# EAGLE design robot_dripper (EAGLE 9.6.2)
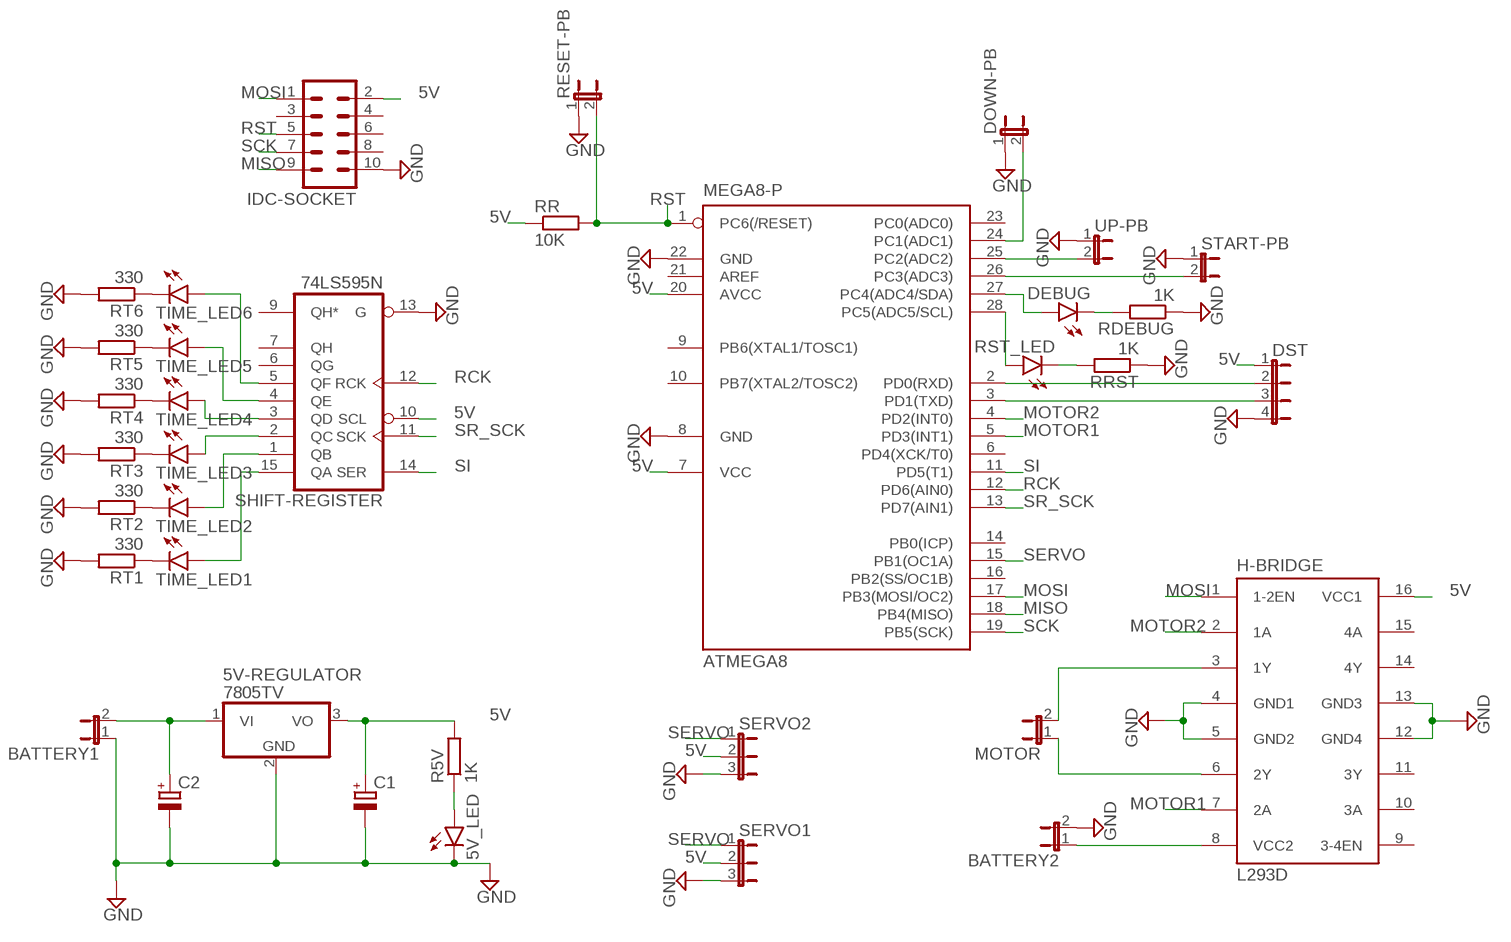
[diagram p0: schematic, sheet 1]

## Parts
5V-REGULATOR  7805TV  [TO220V]
5V_LED  LED5MM  [LED5MM]
ATMEGA8  MEGA8-P  [DIL28-3]
BATTERY1  JP1E  [JP1]
BATTERY2  JP1E  [JP1]
C1  CPOL-EUE5-10.5  [E5-10,5]
C2  CPOL-EUE5-10.5  [E5-10,5]
DEBUG  LED5MM  [LED5MM]
DOWN-PB  JP1E  [JP1]
DST  JP4E  [JP4]
H-BRIDGE  L293D  [DIL16]
IDC-SOCKET  ML10  [ML10]
MOTOR  JP1E  [JP1]
R5V  1K  R-EU_0207/10  [0207/10]
RDEBUG  1K  R-EU_0207/10  [0207/10]
RESET-PB  JP1E  [JP1]
RR  10K  R-EU_0207/10  [0207/10]
RRST  1K  R-EU_0207/10  [0207/10]
RST_LED  LED5MM  [LED5MM]
RT1  330  R-EU_0207/10  [0207/10]
RT2  330  R-EU_0207/10  [0207/10]
RT3  330  R-EU_0207/10  [0207/10]
RT4  330  R-EU_0207/10  [0207/10]
RT5  330  R-EU_0207/10  [0207/10]
RT6  330  R-EU_0207/10  [0207/10]
SERVO1  JP2E  [JP2]
SERVO2  JP2E  [JP2]
SHIFT-REGISTER  74LS595N  [DIL16]
START-PB  JP1E  [JP1]
TIME_LED1  LED5MM  [LED5MM]
TIME_LED2  LED5MM  [LED5MM]
TIME_LED3  LED5MM  [LED5MM]
TIME_LED4  LED5MM  [LED5MM]
TIME_LED5  LED5MM  [LED5MM]
TIME_LED6  LED5MM  [LED5MM]
UP-PB  JP1E  [JP1]

## Nets
5V: 5V-REGULATOR.3(VO) ATMEGA8.7(VCC) ATMEGA8.20(AVCC) C1.+ DST.1 H-BRIDGE.16(VCC1) IDC-SOCKET.2 R5V.2 RR.1 SERVO1.2 SERVO2.2 SHIFT-REGISTER.10(SCL)
GND: 5V-REGULATOR.2(GND) 5V_LED.K(C) ATMEGA8.8(GND) ATMEGA8.22(GND) BATTERY1.1 BATTERY2.2 C1.- C2.- DOWN-PB.1 DST.4 H-BRIDGE.4(GND1) H-BRIDGE.5(GND2) H-BRIDGE.12(GND4) H-BRIDGE.13(GND3) IDC-SOCKET.10 RDEBUG.1 RESET-PB.1 RRST.1 RT1.2 RT2.2 RT3.2 RT4.2 RT5.2 RT6.2 SERVO1.3 SERVO2.3 SHIFT-REGISTER.13(G) START-PB.1 UP-PB.1
MISO: ATMEGA8.18(PB4(MISO)) IDC-SOCKET.9
MOSI: ATMEGA8.17(PB3(MOSI/OC2)) H-BRIDGE.1(1-2EN) IDC-SOCKET.1
MOTOR1: ATMEGA8.5(PD3(INT1)) H-BRIDGE.7(2A)
MOTOR2: ATMEGA8.4(PD2(INT0)) H-BRIDGE.2(1A)
N$1: ATMEGA8.28(PC5(ADC5/SCL)) RST_LED.A
N$2: 5V_LED.A R5V.1
N$3: RRST.2 RST_LED.K(C)
N$4: ATMEGA8.27(PC4(ADC4/SDA)) DEBUG.A
N$5: DEBUG.K(C) RDEBUG.2
N$6: ATMEGA8.26(PC3(ADC3)) START-PB.2
N$7: ATMEGA8.25(PC2(ADC2)) UP-PB.2
N$8: ATMEGA8.24(PC1(ADC1)) DOWN-PB.2
N$9: ATMEGA8.2(PD0(RXD)) DST.2
N$10: ATMEGA8.3(PD1(TXD)) DST.3
N$11: H-BRIDGE.6(2Y) MOTOR.1
N$12: SHIFT-REGISTER.15(QA) TIME_LED1.A
N$13: SHIFT-REGISTER.1(QB) TIME_LED2.A
N$14: SHIFT-REGISTER.2(QC) TIME_LED3.A
N$15: H-BRIDGE.3(1Y) MOTOR.2
N$16: SHIFT-REGISTER.3(QD) TIME_LED4.A
N$17: SHIFT-REGISTER.4(QE) TIME_LED5.A
N$18: SHIFT-REGISTER.5(QF) TIME_LED6.A
N$19: RT1.1 TIME_LED1.K(C)
N$20: RT2.1 TIME_LED2.K(C)
N$21: RT3.1 TIME_LED3.K(C)
N$22: RT4.1 TIME_LED4.K(C)
N$23: RT5.1 TIME_LED5.K(C)
N$24: RT6.1 TIME_LED6.K(C)
N$25: BATTERY2.1 H-BRIDGE.8(VCC2)
N$26: 5V-REGULATOR.1(VI) BATTERY1.2 C2.+
RCK: ATMEGA8.12(PD6(AIN0)) SHIFT-REGISTER.12(RCK)
RST: ATMEGA8.1(PC6(/RESET)) IDC-SOCKET.5 RESET-PB.2 RR.2
SCK: ATMEGA8.19(PB5(SCK)) IDC-SOCKET.7
SERVO: ATMEGA8.15(PB1(OC1A)) SERVO1.1 SERVO2.1
SI: ATMEGA8.11(PD5(T1)) SHIFT-REGISTER.14(SER)
SR_SCK: ATMEGA8.13(PD7(AIN1)) SHIFT-REGISTER.11(SCK)
Unconnected: ATMEGA8.6(PD4(XCK/T0)) ATMEGA8.9(PB6(XTAL1/TOSC1)) ATMEGA8.10(PB7(XTAL2/TOSC2)) ATMEGA8.14(PB0(ICP)) ATMEGA8.16(PB2(SS/OC1B)) ATMEGA8.21(AREF) ATMEGA8.23(PC0(ADC0)) H-BRIDGE.9(3-4EN) H-BRIDGE.10(3A) H-BRIDGE.11(3Y) H-BRIDGE.14(4Y) H-BRIDGE.15(4A) IDC-SOCKET.3 IDC-SOCKET.4 IDC-SOCKET.6 IDC-SOCKET.8 SHIFT-REGISTER.6(QG) SHIFT-REGISTER.7(QH) SHIFT-REGISTER.9(QH*)

## Power pins joined to a net without a drawn wire
5V: SHIFT-REGISTER.16(VCC)
GND: SHIFT-REGISTER.8(GND)

## Library data of the parts
5V-REGULATOR = linear:78*: Positive VOLTAGE REGULATOR Source: http://cache.national.com/ds/LM/LM78L05.pdf http://www.fairchildsemi.com/ds/LM/LM7805.pdf
5V_LED DEBUG RST_LED TIME_LED1-TIME_LED6 = led:LED: LED OSRAM: - CHIPLED LG R971, LG N971, LY N971, LG Q971, LY Q971, LO R971, LY R971 LH N974, LH R974 LS Q976, LO Q976, LY Q976 LO Q996 - Hyper CHIPLED LW Q18S LB Q993, LB Q99A, LB R99A - SideLED LS A670, LO A670, LY A670, LG A670, LP A670 LB A673, LV A673, LT A673, LW A673 LH A674 LY A675 LS A676, LA A676, LO A676, LY A676, LW A676 LS A679, LY A679, LG A679 - Hyper Micro SIDELED® LS Y876, LA Y876, LO Y876, LY Y876 LT Y87S - SmartLED LW L88C, LW L88S LB L89C, LB L89S, LG L890 LS L89K, LO L89K, LY L89K LS L896, LA L896, LO L896, LY L896 - TOPLED LS T670, LO T670, LY T670, LG T670, LP T670 LSG T670, LSP T670, LSY T670, LOP T670, LYG T670 LG T671, LOG T671, LSG T671 LB T673, LV T673, LT T673, LW T673 LH T674 LS T676, LA T676, LO T676, LY T676, LB T676, LH T676, LSB T676, LW T676 LB T67C, LV T67C, LT T67C, LS T67K, LO T67K, LY T67K, LW E67C LS E67B, LA E67B, LO E67B, LY E67B, LB E67C, LV E67C, LT E67C LW T67C LS T679, LY T679, LG T679 LS T770, LO T770, LY T770, LG T770, LP T770 LB T773, LV T773, LT T773, LW T773 LH T774 LS E675, LA E675, LY E675, LS T675 LS T776, LA T776, LO T776, LY T776, LB T776 LHGB T686 LT T68C, LB T68C - Hyper Mini TOPLED® LB M676 - Mini TOPLED Santana® LG M470 LS M47K, LO M47K, LY M47K Source: http://www.osram.convergy.de LUXEON: - LUMILED® LXK2-PW12-R00, LXK2-PW12-S00, LXK2-PW14-U00, LXK2-PW14-V00 LXK2-PM12-R00, LXK2-PM12-S00, LXK2-PM14-U00 LXK2-PE12-Q00, LXK2-PE12-R00, LXK2-PE12-S00, LXK2-PE14-T00, LXK2-PE14-U00 LXK2-PB12-K00, LXK2-PB12-L00, LXK2-PB12-M00, LXK2-PB14-N00, LXK2-PB14-P00, LXK2-PB14-Q00 LXK2-PR12-L00, LXK2-PR12-M00, LXK2-PR14-Q00, LXK2-PR14-R00 LXK2-PD12-Q00, LXK2-PD12-R00, LXK2-PD12-S00 LXK2-PH12-R00, LXK2-PH12-S00 LXK2-PL12-P00, LXK2-PL12-Q00, LXK2-PL12-R00 Source: www.luxeon.com KINGBRIGHT: KA-3528ASYC Source: www.kingbright.com
ATMEGA8 = atmel:MEGA8-P: MICROCONTROLLER 8 Kbytes FLASH, 1 kbytes SRAM, 512 bytes EEPROM, USART, 4-channel 10 bit ADC, 2-channel 8 bit ADC Pin compatible with Atmega48, ATMega88, ATMega168 Source: avr.lbr; OC_FARNELL: unknown; OC_NEWARK: unknown
BATTERY1 BATTERY2 DOWN-PB MOTOR RESET-PB START-PB UP-PB = jumper:JP1E: JUMPER
C1 C2 = rcl:CPOL-EU: POLARIZED CAPACITOR, European symbol; SPICEPREFIX: C
DST = jumper:JP4E: JUMPER
H-BRIDGE = st-microelectronics:L293D: PUSH-PULL 4 CHANNEL DRIVER; MPN: L293D; OC_FARNELL: 9589619; OC_NEWARK: 56P8249
IDC-SOCKET = con-harting-ml:ML10: HARTING; OC_FARNELL: unknown; OC_NEWARK: unknown
R5V RDEBUG RR RRST RT1-RT6 = rcl:R-EU_: RESISTOR, European symbol; SPICEPREFIX: R
SERVO1 SERVO2 = jumper:JP2E: JUMPER
SHIFT-REGISTER = 74xx-us:74*595: 8-bit SHIFT REGISTER, output latch

## Board
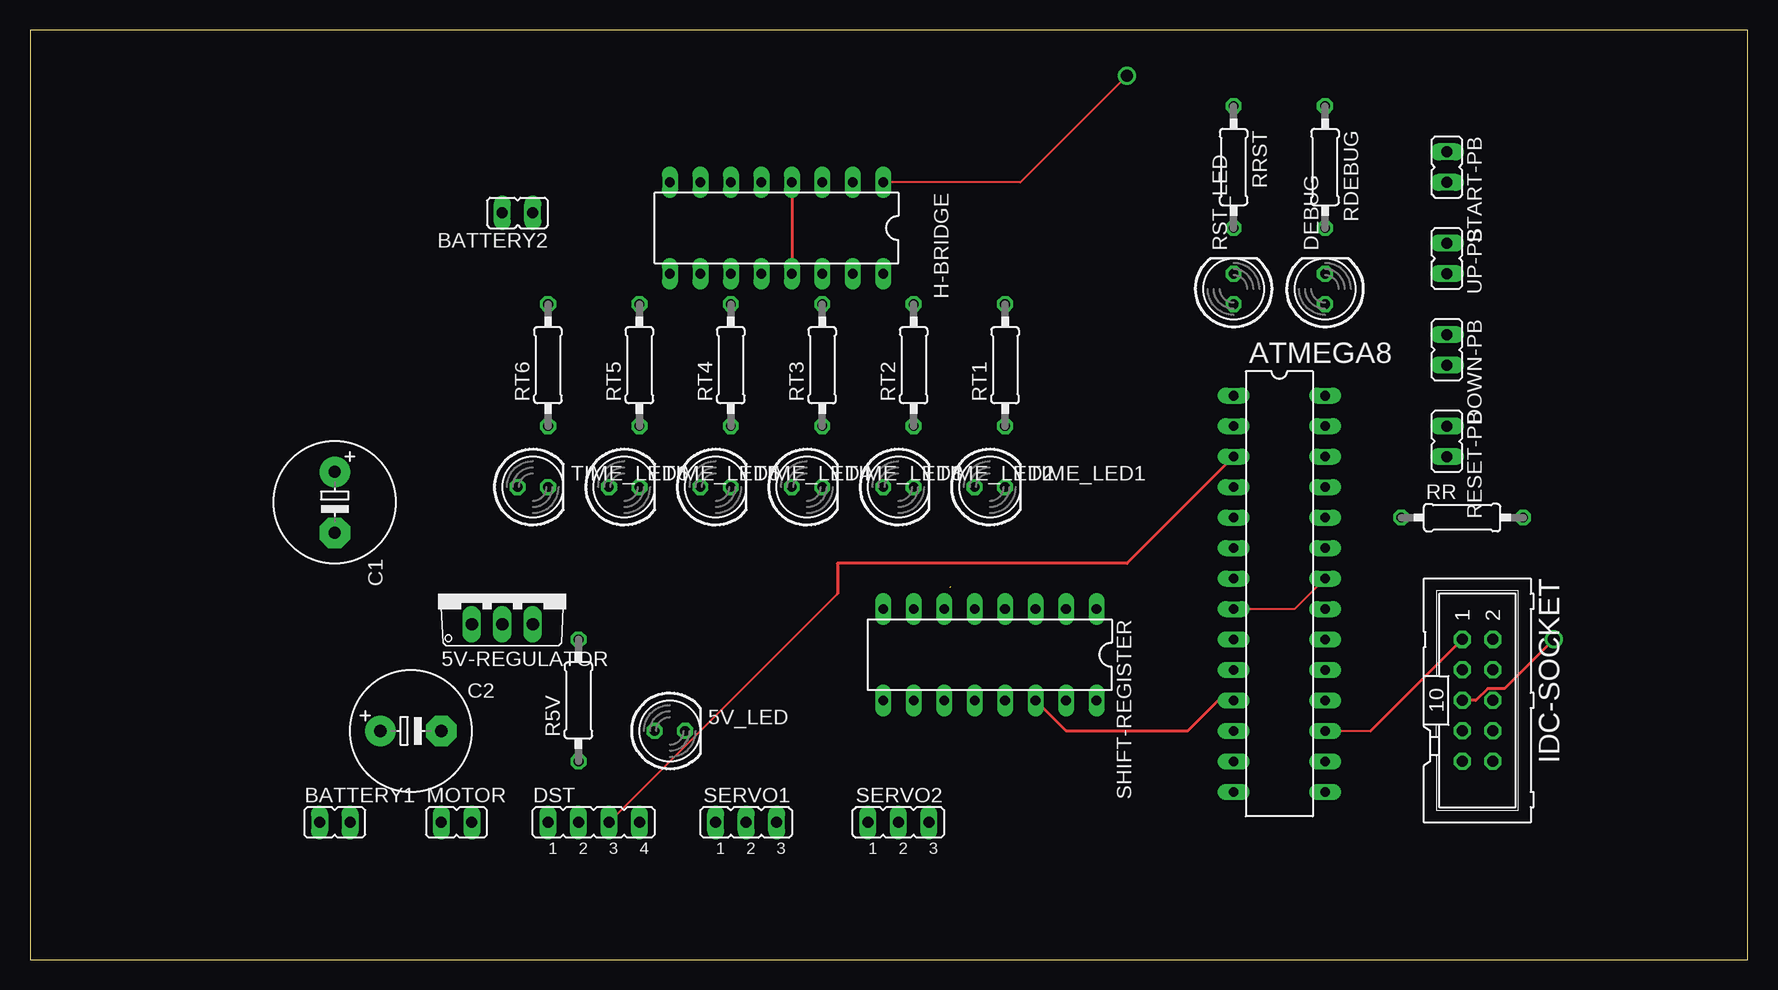
[diagram p1: board, top side]
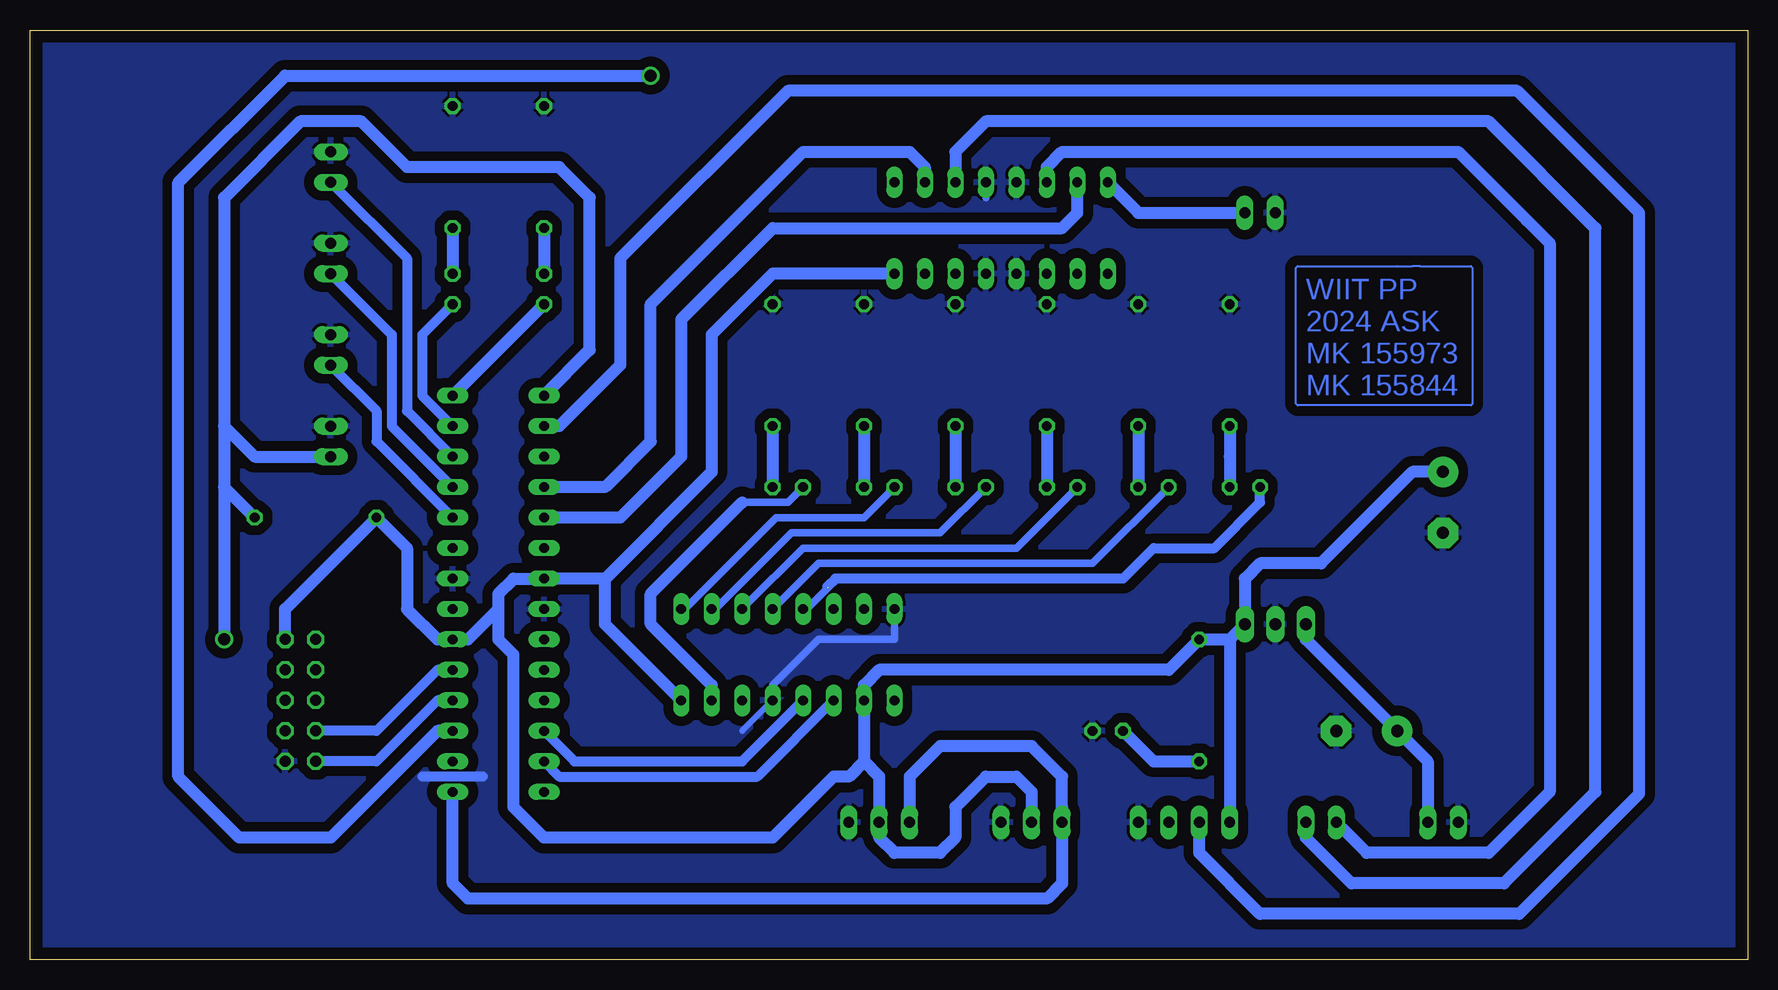
[diagram p2: board, bottom side, seen from below]

Size 143.18 x 77.46 mm. Coordinates in mm from the lower left corner, seen from the top.
Outline: 0,0 143.18,0 143.18,77.46 0,77.46 0,0
Copper layers (1*16): Top 0.035mm / dielectric 1.5mm / Bottom 0.035mm
Design rules "default": minimum track width 6mil, minimum drill 0.35mm, track to track 6mil, track to pad 6mil, pad to pad 6mil, via to via 6mil, smd to smd 6mil, copper to edge 40mil, drill to drill 6mil, minimum pad ring 10mil, minimum via ring 8mil, stop-mask expansion 4mil, vias tented up to drill 0mil, thermal gap 10mil

### Footprints (pad centres in the part's own frame; a part is rotated, then mirrored left to right if it is on the bottom)
TO220V = drill 1.016 long: 1 -2.54,-2.54; 2 0,-2.54; 3 2.54,-2.54
LED5MM = drill 0.813 octagon: A -1.27,0; K 1.27,0
DIL28-3 = drill 0.813 long: 1 -16.51,-3.81; 2 -13.97,-3.81; 3 -11.43,-3.81; 4 -8.89,-3.81; 5 -6.35,-3.81; 6 -3.81,-3.81; 7 -1.27,-3.81; 8 1.27,-3.81; 9 3.81,-3.81; 10 6.35,-3.81; 11 8.89,-3.81; 12 11.43,-3.81; 13 13.97,-3.81; 14 16.51,-3.81; 15 16.51,3.81; 16 13.97,3.81; 17 11.43,3.81; 18 8.89,3.81; 19 6.35,3.81; 20 3.81,3.81; 21 1.27,3.81; 22 -1.27,3.81; 23 -3.81,3.81; 24 -6.35,3.81; 25 -8.89,3.81; 26 -11.43,3.81; 27 -13.97,3.81; 28 -16.51,3.81
JP1 = drill 0.914 long: 1 0,-1.27; 2 0,1.27
E5-10,5 = drill 1.016 pad 2.54: + -2.54,0 | drill 1.016 pad 2.54 octagon: - 2.54,0
JP4 = drill 0.914 long: 1 -3.81,0; 2 -1.27,0; 3 1.27,0; 4 3.81,0
DIL16 = drill 0.813 long: 1 -8.89,-3.81; 2 -6.35,-3.81; 3 -3.81,-3.81; 4 -1.27,-3.81; 5 1.27,-3.81; 6 3.81,-3.81; 7 6.35,-3.81; 8 8.89,-3.81; 9 8.89,3.81; 10 6.35,3.81; 11 3.81,3.81; 12 1.27,3.81; 13 -1.27,3.81; 14 -3.81,3.81; 15 -6.35,3.81; 16 -8.89,3.81
ML10 = drill 0.914 octagon: 1 -5.08,-1.27; 2 -5.08,1.27; 3 -2.54,-1.27; 4 -2.54,1.27; 5 0,-1.27; 6 0,1.27; 7 2.54,-1.27; 8 2.54,1.27; 9 5.08,-1.27; 10 5.08,1.27
0207/10 = drill 0.813 octagon: 1 -5.08,0; 2 5.08,0
JP2 = drill 0.914 long: 1 -2.54,0; 2 0,0; 3 2.54,0

### Placement (x,y rotation side)
5V-REGULATOR  39.37,30.48 0 top
5V_LED  53.34,19.05 0 top
ATMEGA8  104.14,30.48 270 top
BATTERY1  25.4,11.43 270 top
BATTERY2  40.64,62.23 90 top
C1  25.4,38.1 270 top
C2  31.75,19.05 0 top
DEBUG  107.95,55.88 90 top
DOWN-PB  118.11,50.8 180 top
DST  46.99,11.43 0 top
H-BRIDGE  62.23,60.96 180 top
IDC-SOCKET  120.65,21.59 270 top
MOTOR  35.56,11.43 270 top
R5V  45.72,21.59 90 top
RDEBUG  107.95,66.04 270 top
RESET-PB  118.11,43.18 180 top
RR  119.38,36.83 0 top
RRST  100.33,66.04 270 top
RST_LED  100.33,55.88 90 top
RT1  81.28,49.53 90 top
RT2  73.66,49.53 90 top
RT3  66.04,49.53 90 top
RT4  58.42,49.53 90 top
RT5  50.8,49.53 90 top
RT6  43.18,49.53 90 top
SERVO1  59.69,11.43 0 top
SERVO2  72.39,11.43 0 top
SHIFT-REGISTER  80.01,25.4 180 top
START-PB  118.11,66.04 180 top
TIME_LED1  80.01,39.37 0 top
TIME_LED2  72.39,39.37 0 top
TIME_LED3  64.77,39.37 0 top
TIME_LED4  57.15,39.37 0 top
TIME_LED5  49.53,39.37 0 top
TIME_LED6  41.91,39.37 0 top
UP-PB  118.11,58.42 180 top

### Tracks (layer width: path | path; a pad name or v marks a point on that pad's centre or on a via)
5V
  Bottom 0.152: 88.95,21.54 SHIFT-REGISTER.16 | 100.53,31.6 ATMEGA8.7 | 107.85,26.42 ATMEGA8.20 | 121.61,26.42 IDC-SOCKET.2
  Bottom 0.61: ATMEGA8.7 100.84,31.75
  Bottom 0.813: 109.22,26.67 ATMEGA8.20 106.68,26.67
  Bottom 1.016: 109.22,26.67 111.76,29.21 111.76,34.29 RR.1 121.92,29.21 IDC-SOCKET.2 | H-BRIDGE.16 81.28,57.15 86.36,52.07 86.36,40.64 95.25,31.75 | 95.25,31.75 ATMEGA8.7 102.87,31.75 104.14,30.48 104.14,29.21 | 43.18,26.67 R5V.2 48.26,24.13 72.39,24.13 73.66,22.86 SHIFT-REGISTER.10 73.66,16.51 | 43.18,26.67 5V-REGULATOR.3 41.91,31.75 40.64,33.02 35.56,33.02 27.94,40.64 C1.+ | 106.68,26.67 104.14,29.21 | 104.14,29.21 104.14,26.67 102.87,25.4 102.87,12.7 100.33,10.16 81.28,10.16 76.2,15.24 74.93,15.24 73.66,16.51 | SHIFT-REGISTER.16 95.25,27.94 95.25,31.75 | 73.66,16.51 72.39,15.24 SERVO2.2 72.39,10.16 71.12,8.89 67.31,8.89 66.04,10.16 66.04,12.7 63.5,15.24 60.96,15.24 59.69,13.97 SERVO1.2 | 43.18,26.67 DST.1
GND
  Top 0.152: ATMEGA8.22 105.41,29.21 ATMEGA8.8
  Top 0.254: H-BRIDGE.4 H-BRIDGE.13
  Bottom 0.152: 71.12,29.16 SHIFT-REGISTER.8 | 118.11,67.26 START-PB.1 | 107.9,31.75 ATMEGA8.22 | 107.9,71.22 RDEBUG.1 108.05,71.07 | 100.48,71.22 RRST.1
  Bottom 0.508: SHIFT-REGISTER.13 83.82,19.05
  Bottom 0.61: SHIFT-REGISTER.8 71.12,26.67 77.47,26.67 81.28,22.86 SHIFT-REGISTER.13 | H-BRIDGE.4 63.5,63.5
  Bottom 0.813: 105.41,15.24 110.49,15.24
  pour Bottom (isolate 0.813): -6.35,83.82 147.32,83.82 147.32,-12.7 -6.35,-12.7
MISO
  Bottom 0.61: IDC-SOCKET.9 119.28,16.51
  Bottom 0.813: ATMEGA8.18 109.22,21.59 114.3,16.51 IDC-SOCKET.9
MOSI  (via drill 1)
  Top 0.152: ATMEGA8.17 111.76,19.05 | v91.44,73.66 82.55,64.77 H-BRIDGE.1
  Top 0.254: 111.76,19.05 IDC-SOCKET.1
  Bottom 1.016: ATMEGA8.17 109.22,19.05 118.11,10.16 125.73,10.16 130.81,15.24 130.81,64.77 121.92,73.66 v91.44,73.66
MOTOR1
  Bottom 1.016: ATMEGA8.5 93.98,36.83 88.9,41.91 88.9,53.34 81.28,60.96 57.15,60.96 55.88,62.23 H-BRIDGE.7
MOTOR2
  Bottom 1.016: H-BRIDGE.2 68.58,66.04 69.85,67.31 78.74,67.31 91.44,54.61 91.44,43.18 95.25,39.37 ATMEGA8.4
N$1
  Bottom 1.016: ATMEGA8.28 RST_LED.A
N$2
  Bottom 1.016: 5V_LED.A 49.53,16.51 R5V.1
N$3
  Bottom 1.016: RRST.2 RST_LED.K
N$4
  Bottom 0.813: DEBUG.A 110.49,52.07 110.49,46.99 ATMEGA8.27
N$5
  Bottom 1.016: RDEBUG.2 DEBUG.K
N$6
  Bottom 0.813: START-PB.2 111.76,58.42 111.76,45.72 ATMEGA8.26
N$7
  Bottom 0.813: UP-PB.2 113.03,52.07 113.03,44.45 ATMEGA8.25
N$8
  Bottom 0.813: ATMEGA8.24 114.3,43.18 114.3,45.72 DOWN-PB.2
N$9
  Bottom 1.016: ATMEGA8.2 99.06,44.45 93.98,49.53 93.98,58.42 80.01,72.39 19.2,72.39 9.04,62.23 9.04,13.82 19.05,3.81 40.64,3.81 45.72,8.89 DST.2
N$10  (via drill 0.65 pad 0.95)
  Top 0.152: 67.31,30.48 DST.3
  Top 0.254: ATMEGA8.3 91.44,33.02 67.31,33.02 67.31,30.48
  other vias: 100.33,41.91
N$11
  Bottom 0.152: 27.31,57.78 27.94,57.78 29.21,57.78 37.52,57.78 37.65,57.65 37.65,46.3 37.52,46.17 23.06,46.17 22.93,46.3 22.93,57.65 23.06,57.78 27.31,57.78
  Bottom 0.813: 58.42,64.87 58.37,64.82
  Bottom 1.016: MOTOR.1 31.75,8.89 21.59,8.89 16.51,13.97 16.51,59.69 18.41,61.6 24.13,67.31 57.15,67.31 58.42,66.04 H-BRIDGE.6 58.37,64.82 58.37,65.58
N$12
  Bottom 0.61: TIME_LED1.A 80.01,38.1 83.82,38.1
  Bottom 1.016: 83.82,38.1 91.44,30.48 91.44,27.94 86.36,22.86 SHIFT-REGISTER.15
N$13
  Bottom 0.61: SHIFT-REGISTER.1 88.6,29.21 80.98,36.83 73.66,36.83 TIME_LED2.A
N$14
  Bottom 0.61: SHIFT-REGISTER.2 86.06,29.21 79.71,35.56 67.31,35.56 TIME_LED3.A
N$15
  Bottom 1.016: H-BRIDGE.3 66.04,67.31 63.5,69.85 21.59,69.85 12.7,60.96 12.7,13.97 20.32,6.35 33.02,6.35 36.83,10.16 MOTOR.2
N$16
  Bottom 0.61: SHIFT-REGISTER.3 83.52,29.21 83.52,29.51 78.74,34.29 60.96,34.29 TIME_LED4.A
N$17
  Bottom 0.61: 80.98,29.21 SHIFT-REGISTER.4 77.47,33.02 54.61,33.02 TIME_LED5.A
N$18  (1 unrouted)
  Bottom 0.61: SHIFT-REGISTER.5 78.44,29.21 76.66,30.99
  Bottom 0.813: TIME_LED6.A 40.64,38.1 44.45,34.29 49.53,34.29 52.07,31.75 75.9,31.75 76.05,31.75 76.7,31.09 76.73,31.06
N$19
  Bottom 1.016: RT1.1 TIME_LED1.K
N$20
  Bottom 1.016: RT2.1 TIME_LED2.K
N$21
  Bottom 1.016: RT3.1 TIME_LED3.K
N$22
  Bottom 1.016: RT4.1 TIME_LED4.K
N$23
  Bottom 1.016: RT5.1 TIME_LED5.K
N$24
  Bottom 0.813: 43.18,41.91
  Bottom 1.016: RT6.1 43.18,41.91 TIME_LED6.K
N$25
  Bottom 1.016: H-BRIDGE.8 50.8,62.23 BATTERY2.1
N$26
  Bottom 1.016: 5V-REGULATOR.1 36.83,26.67 C2.+ 26.67,16.51 BATTERY1.2
RCK
  Bottom 0.813: ATMEGA8.12 97.79,16.51 83.82,16.51 SHIFT-REGISTER.12
RST  (via drill 1)
  Top 0.254: v127,26.67 122.91,22.58 121.51,22.58 120.52,21.59 IDC-SOCKET.5
  Bottom 1.016: ATMEGA8.1 96.52,50.8 96.52,63.5 99.06,66.04 111.76,66.04 115.57,69.85 120.65,69.85 127,63.5 127,44.45 | 127,44.45 127,39.37 | 127,39.37 v127,26.67 | 127,39.37 RR.2 | 127,44.45 124.46,41.91 RESET-PB.2
SCK
  Bottom 0.61: IDC-SOCKET.7 119.33,19.05
  Bottom 0.813: ATMEGA8.19 109.22,24.13 114.3,19.05 IDC-SOCKET.7
SERVO
  Bottom 0.813: 57.15,10.16 SERVO1.1
  Bottom 1.016: ATMEGA8.15 107.95,6.35 106.68,5.08 58.42,5.08 57.15,6.35 SERVO1.1 | SERVO1.1 57.15,12.7 | SERVO1.1 57.15,15.24 59.69,17.78 67.31,17.78 69.85,15.24 SERVO2.1
SI
  Top 0.254: SHIFT-REGISTER.14 86.36,19.05 96.52,19.05 99.06,21.59 ATMEGA8.11
SR_SCK
  Bottom 0.813: SHIFT-REGISTER.11 82.55,15.24 99.06,15.24 ATMEGA8.13

### Text on the board
Bottom: WIIT PP / 2024 ASK / MK 155973 / MK 155844